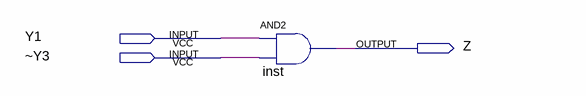
[diagram p0: schematic sheet]
// Quartus schematic Z.bdf as structural Verilog: 1 symbols, 3 pins
module Z (
  input  Y1,
  input  \~Y3 ,
  output Z
);

  and inst (Z, Y1, \~Y3 );
endmodule
